# Altium schematic sheet VCO_OUT_channel.SchDoc: Output stage :
size 420 x 297 mm; Author: K.B.; CompanyName: WUT; DrawnBy: K.B.; Organization: WUT ISE; Address1: Warsaw Univeristy of Technology; Address2: Nowowiejska 15/19; DocumentNumber: 4; SheetNumber: 4; SheetTotal: 12; EDA_Number: ARTIQ; Projet: ARTIQ/SINARA; ModifiedBy: -; CreateDate: XX/XX/XXXX; CheckedDate: -; Title2: Attenuator, amplifier and filter; DivGrp: ISE; Designer: K.B.; ModifiedDate: -; ProjectName: ARTIQ/SINARA
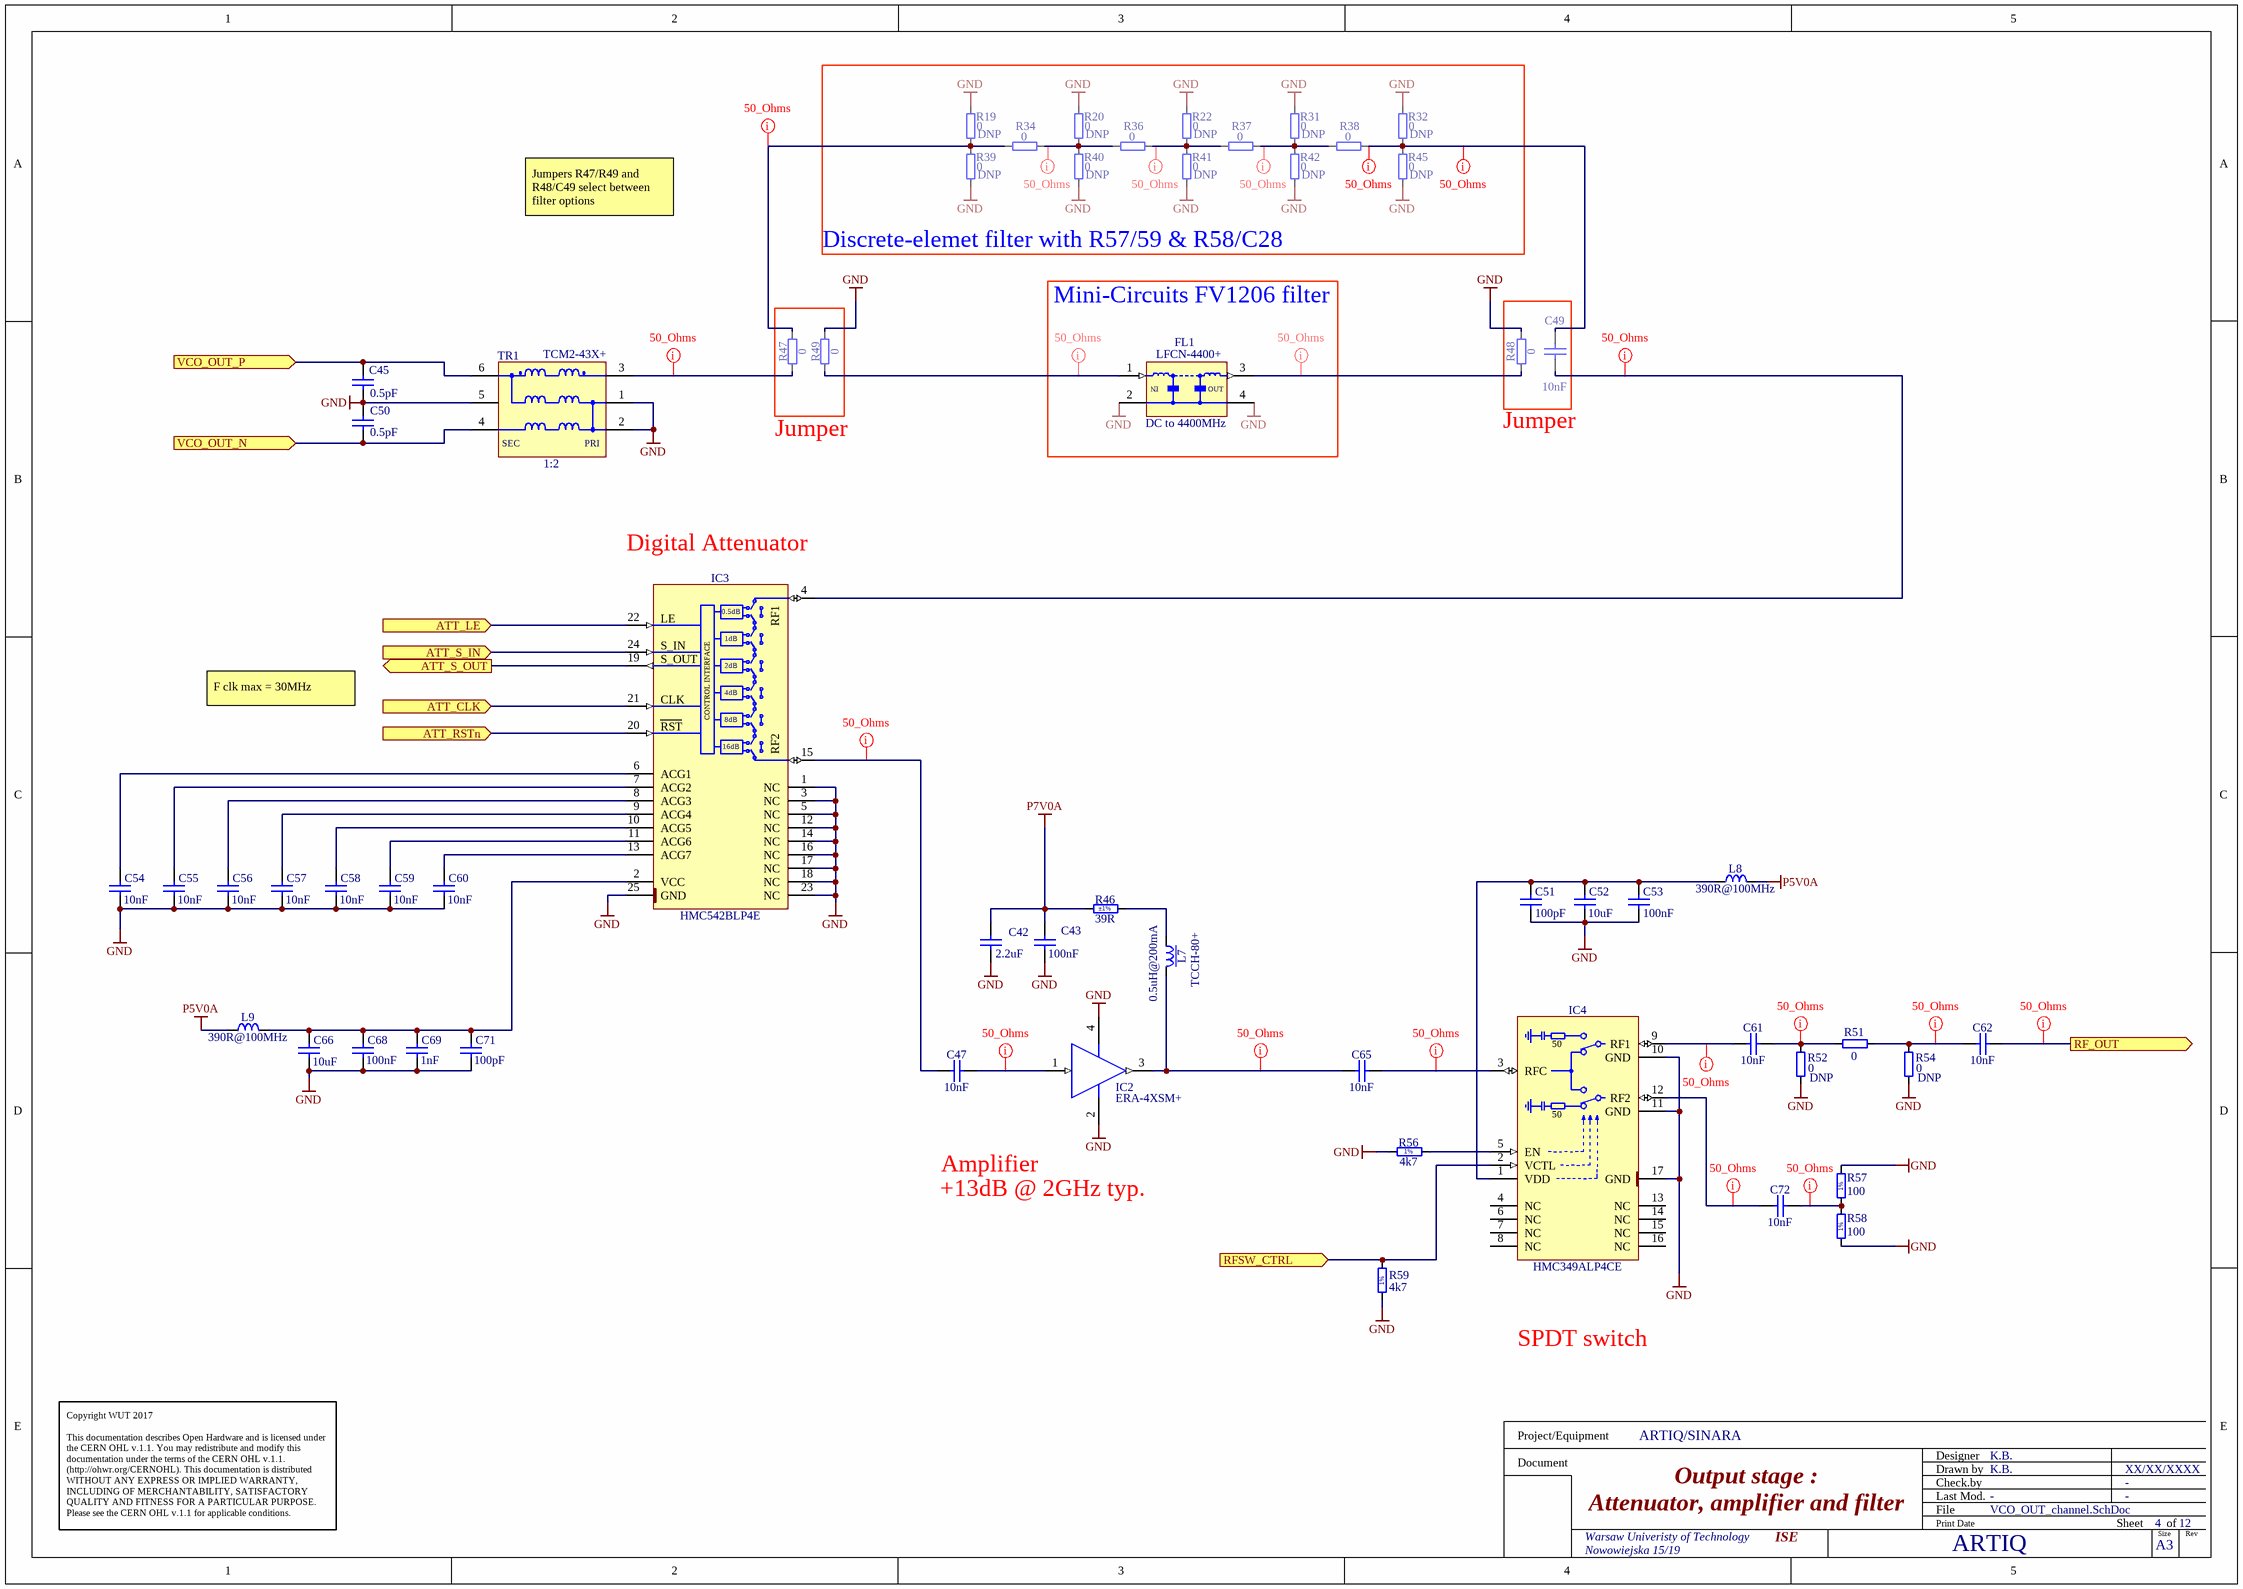
[diagram p0: VCO_OUT_channel.SchDoc]

## Parts
C42  2.2uF  [CAPC2012X140N]
C43  100nF  [CAPC1005X55N]
C45  0.5pF  [CAPC0402(1005)60_M]
C47  10nF  [CAPC1005X55N]
C49  10nF  [CAPC1005X55N]
C50  0.5pF  [CAPC0402(1005)60_M]
C51  100pF  [CAPC1005X55N]
C52  10uF  [CAPC1608X80N]
C53  100nF  [CAPC1005X55N]
C54  10nF  [CAPC1005X55N]
C55  10nF  [CAPC1005X55N]
C56  10nF  [CAPC1005X55N]
C57  10nF  [CAPC1005X55N]
C58  10nF  [CAPC1005X55N]
C59  10nF  [CAPC1005X55N]
C60  10nF  [CAPC1005X55N]
C61  10nF  [CAPC1005X55N]
C62  10nF  [CAPC1005X55N]
C65  10nF  [CAPC1005X55N]
C66  10uF  [CAPC1608X80N]
C68  100nF  [CAPC1005X55N]
C69  1nF  [CAPC1005X55N]
C71  100pF  [CAPC1005X55N]
C72  10nF  [CAPC1005X55N]
FL1  DC to 4400MHz  Manufacturer Part Number: LFCN-4400+  [FIL_MINI-CIRCUITS_FV1206]
IC2  ERA-4XSM+  [MINI-CIRCUITS_WW107]
IC3  HMC542BLP4E  [QFN50P400X400X100-25N-S295]
IC4  HMC349ALP4CE  [QFN65P400X400X100-17N-S255]
L7  0.5uH@200mA  Manufacturer Part Number: TCCH-80+  [IND_MINI-CIRCUITS_GU1604]
L8  390R@100MHz  [INDC1608X95N]
L9  390R@100MHz  [INDC1608X95N]
R19  0  Mounted: DNP  [RESC1005X40N]
R20  0  Mounted: DNP  [RESC1005X40N]
R22  0  Mounted: DNP  [RESC1005X40N]
R31  0  Mounted: DNP  [RESC1005X40N]
R32  0  Mounted: DNP  [RESC1005X40N]
R34  0  [RESC1005X40N]
R36  0  [RESC1005X40N]
R37  0  [RESC1005X40N]
R38  0  [RESC1005X40N]
R39  0  Mounted: DNP  [RESC1005X40N]
R40  0  Mounted: DNP  [RESC1005X40N]
R41  0  Mounted: DNP  [RESC1005X40N]
R42  0  Mounted: DNP  [RESC1005X40N]
R45  0  Mounted: DNP  [RESC1005X40N]
R46  39R  Tolerance: ±1%  [RESC3225X70N]
R47  0  [RESC1005X40N]
R48  0  [RESC1005X40N]
R49  0  [RESC1005X40N]
R51  0  [RESC1005X40N]
R52  0  Mounted: DNP  [RESC1005X40N]
R54  0  Mounted: DNP  [RESC1005X40N]
R56  4k7  [RESC1005X40N]
R57  100  [RESC1005X40N]
R58  100  [RESC1005X40N]
R59  4k7  [RESC1005X40N]
TR1  1:2  Manufacturer Part Number: TCM2-43X+  [XFMR_MINI-CIRCUITS_DB1627]

## Blocks framed on the sheet
Discrete-elemet filter with R57/59 & R58/C28: R19 R20 R22 R31 R32 R34 R36-R42 R45
Mini-Circuits FV1206 filter: FL1

## Ports
ATT_CLK (in), ATT_LE (in), ATT_RSTn (in), ATT_S_IN (in), ATT_S_OUT (out), RF_OUT (out), RFSW_CTRL (in), VCO_OUT_N (in), VCO_OUT_P (in)

## Nets
GND: C42.1 C43.1 C45.1 C50.2 C51.2 C52.1 C53.1 C54.1 C55.1 C56.1 C57.1 C58.1 C59.1 C60.1 C66.1 C68.1 C69.1 C71.1 FL1.2(GND) FL1.4(GND) IC2.2(GND) IC2.4(GND) IC3.1(NC) IC3.3(NC) IC3.5(NC) IC3.12(NC) IC3.14(NC) IC3.16(NC) IC3.17(NC) IC3.18(NC) IC3.23(NC) IC3.25(GND) IC4.10(GND) IC4.11(GND) IC4.17(GND) R19.1 R20.1 R22.1 R31.1 R32.1 R39.1 R40.1 R41.1 R42.1 R45.1 R48.1 R49.2 R52.1 R54.1 R56.1 R57.2 R58.1 R59.1 TR1.1(P1) TR1.2(P1) TR1.5(NC)
P5V0A: L8.2 L9.1
P7V0A: C42.2 C43.2 R46.1
ATT_CLK: IC3.21(SHIFT_CLOCK) ; port ATT_CLK
ATT_LE: IC3.22(LATCH_ENABLE) ; port ATT_LE
ATT_RSTn: IC3.20(~{RESET}) ; port ATT_RSTn
ATT_S_IN: IC3.24(SERIAL_INPUT) ; port ATT_S_IN
ATT_S_OUT: IC3.19(SERIAL_OUTPUT) ; port ATT_S_OUT
RF_OUT: C62.2 ; port RF_OUT
RFSW_CTRL: IC4.2(VCTL) R59.2 ; port RFSW_CTRL
VCO_OUT_N: C50.1 TR1.4(S1) ; port VCO_OUT_N
VCO_OUT_P: C45.2 TR1.6(S1) ; port VCO_OUT_P
NetC47_1: C47.1 IC3.15(RF2)
NetC47_2: C47.2 IC2.1(RF_IN)
NetC49_1: C49.1 IC3.4(RF1)
NetC49_2: C49.2 R32.2 R38.1 R45.2
NetC51_1: C51.1 C52.2 C53.2 IC4.1(VDD) L8.1
NetC54_2: C54.2 IC3.6(ACG1)
NetC55_2: C55.2 IC3.7(ACG2)
NetC56_2: C56.2 IC3.8(ACG3)
NetC57_2: C57.2 IC3.9(ACG4)
NetC58_2: C58.2 IC3.10(ACG5)
NetC59_2: C59.2 IC3.11(ACG6)
NetC60_2: C60.2 IC3.13(ACG7)
NetC61_1: C61.1 IC4.9(RF1)
NetC61_2: C61.2 R51.1 R52.2
NetC62_1: C62.1 R51.2 R54.2
NetC65_1: C65.1 IC2.3(RF_OUT) L7.3
NetC65_2: C65.2 IC4.3(RFC)
NetC66_2: C66.2 C68.2 C69.2 C71.2 IC3.2(VCC) L9.2
NetC72_1: C72.1 IC4.12(RF2)
NetC72_2: C72.2 R57.1 R58.2
NetFL1_1: FL1.1(RFIN) R49.1
NetFL1_3: FL1.3(RFOUT) R48.2
NetIC4_5: IC4.5(EN) R56.2
NetL7_1: L7.1 R46.2
NetR19_2: R19.2 R34.1 R39.2 R47.2
NetR20_2: R20.2 R34.2 R36.1 R40.2
NetR22_2: R22.2 R36.2 R37.1 R41.2
NetR31_2: R31.2 R37.2 R38.2 R42.2
NetR47_1: R47.1 TR1.3(P1)

Not connected (* = marked no-connect by the designer): IC4 4(NC) 6(NC) 7(NC) 8(NC) 13(NC) 14(NC) 15(NC) 16(NC)

## Layout directives
net class 50_Ohms: NetC47_1, NetC47_2, NetC49_1, NetC49_2, NetC61_1, NetC61_2, NetC62_1, NetC65_1, NetC65_2, NetC72_1, NetC72_2, NetFL1_1, NetFL1_3, NetR19_2, NetR20_2, NetR22_2, NetR31_2, NetR47_1, RF_OUT

## Notes on the sheet
- Jumpers R47/R49 and R48/C49 select between filter options
- Jumper
- (near IC3) Digital Attenuator
- F clk max = 30MHz
- +13dB @ 2GHz typ.
- Amplifier
- SPDT switch
- Copyright WUT 2017
  This documentation describes Open Hardware and is licensed under the CERN OHL v.1.1. You may redistribute and modify this documentation under the terms of the CERN OHL v.1.1. (http://ohwr.org/CERNOHL). This documentation is distributed WITHOUT ANY EXPRESS OR IMPLIED WARRANTY, INCLUDING OF MERCHANTABILITY, SATISFACTORY QUALITY AND FITNESS FOR A PARTICULAR PURPOSE. Please see the CERN OHL v.1.1 for applicable conditions.
- Project/Equipment
- Document
- Designer
- Drawn by
- Check.by
- File
- Last Mod.
- Print Date
- Sheet
- Size
- A3
- of
- Rev
- (in symbol FIL_MINI-CIRCUITS_LFCN-320) IN; OUT
- (in symbol HMC349ALP4CE) 50
- (in symbol HMC542BLP4E) 0.5dB; LE; 1dB; S_IN; S_OUT; 2dB; CONTROL INTERFACE; 4dB; CLK; 8dB; RST; 16dB
- (in symbol R0402_4K7_1%_0.0625W_100PPM) 1%
- (in symbol R0402_100R_1%_0.1W_100PPM) 1%
- (in symbol XFMR_MINI-CIRCUITS_TCM2-43X+) SEC; PRI

## Library data of the parts
C42 = CC0805_1UF_35V_20%_X7R: Non-polarised capacitor; Part Number: CC0805_2U2F_25V_20%_X7R; Part Description: SMD Multilayer Chip Ceramic Capacitor; Manufacturer: GENERIC; Manufacturer1 Part Number: TMK212B7225MG-TR; Voltage: 25V; TC: X7R; Tolerance: ±20%; Component Kind: Standard; Component Type: Standard; Pin Count: 2; Value: 2.2uF; Status: Not Recommended; Manufacturer Part Number: CC0805_2U2F_25V_20%_X7R; Case: 0805; Mounted: Yes; Socket: No; SMD: Yes; Sense: No; Manufacturer1 Example: TAIYO YUDEN; Manufacturer1 ComponentHeight: 1.35mm; HelpURL: \\cern.ch\dfs\Applications\Altium\Datasheets\CC0805_X7R_TAIYO-YUDEN_HIGH-VALUE.pdf; Author: CERN DEM JLC; CreateDate: 2011-06-22; LatestRevisionDate: 2011-06-22
C43 C53 C68 = CC0402_100NF_16V_10%_X7R: Non-polarised capacitor; Part Description: SMD Multilayer Chip Ceramic Capacitor; Manufacturer: GENERIC; Manufacturer1 Part Number: GRM155R71C104KA88D; Voltage: 16V; TC: X7R; Tolerance: ±10%; Part Number: CC0402_100NF_16V_10%_X7R; Component Kind: Standard; Component Type: Standard; Pin Count: 2; Value: 100nF; Status: Not Recommended; Manufacturer Part Number: CC0402_100NF_16V_10%_X7R; Case: 0402; Mounted: Yes; Socket: No; SMD: Yes; Sense: No; Manufacturer1 Example: MURATA; Manufacturer1 ComponentHeight: 0.55mm; HelpURL: \\cern.ch\dfs\Applications\Altium\Datasheets\CC0402_X7R_MURATA_GRM.pdf; Author: CERN DEM JLC; CreateDate: 2013-12-05; LatestRevisionDate: 2007-12-03
C45 C50 = CMP-1034-00013-1: CAP 0.5pF 10V ±0.1pF 0402 (1005 Metric) Thickness 0.6mm SMD; Case-Metric: 1005; Tolerance: Â±0.1pF; Case-EIA: 0402; Value: 0.5pF; Max Thickness: 0.6 mm; Rated Voltage: 10 V; Technology: SMT
C47 C49 C54-C62 C65 C72 = CC0402_10NF_16V_10%_X7R: Non-polarised capacitor; Part Description: SMD Multilayer Chip Ceramic Capacitor; Manufacturer: GENERIC; Manufacturer1 Part Number: 223878715636; Voltage: 16V; TC: X7R; Tolerance: ±10%; Part Number: CC0402_10NF_16V_10%_X7R; Component Kind: Standard; Component Type: Standard; Pin Count: 2; Value: 10nF; Status: Not Recommended; Manufacturer Part Number: CC0402_10NF_16V_10%_X7R; Case: 0402; Mounted: Yes; Socket: No; SMD: Yes; Sense: No; Manufacturer1 Example: PHYCOMP; Manufacturer1 ComponentHeight: 0.55mm; HelpURL: \\cern.ch\dfs\Applications\Altium\Datasheets\CC0402_X7R_PHYCOMP.pdf; Author: CERN DEM JLC; CreateDate: 2007-12-03; LatestRevisionDate: 2007-12-03
C51 C71 = CC0402_100PF_50V_5%_C0G: Non-polarised capacitor; Part Description: SMD Multilayer Chip Ceramic Capacitor; Manufacturer: GENERIC; Manufacturer1 Part Number: C0402C101J5GACTU; Voltage: 50V; TC: C0G/NP0; Tolerance: ±5%; Part Number: CC0402_100PF_50V_5%_C0G; Component Kind: Standard; Component Type: Standard; Pin Count: 2; Value: 100pF; Status: Preferred; Manufacturer Part Number: CC0402_100PF_50V_5%_C0G; Case: 0402; Mounted: Yes; Socket: No; SMD: Yes; Sense: No; Manufacturer1 Example: KEMET; Manufacturer1 ComponentHeight: 0.55mm; HelpURL: \\cern.ch\dfs\Applications\Altium\Datasheets\CC0805_C0G_KEMET_(Commercial Grade).pdf; Author: CERN DEM JLC; CreateDate: 2007-12-03; LatestRevisionDate: 2015-04-22
C52 C66 = CC0603_10UF_16V_20%_X5R: Non-polarised capacitor; Part Description: SMD Multilayer Chip Ceramic Capacitor; Manufacturer: GENERIC; Manufacturer1 Part Number: GRM188R61C106MA73D; Voltage: 16V; TC: X5R; Tolerance: ±20%; Part Number: CC0603_10UF_16V_20%_X5R; Component Kind: Standard; Component Type: Standard; Pin Count: 2; Value: 10uF; Status: None; Manufacturer Part Number: CC0603_10UF_16V_20%_X5R; Case: 0603; Mounted: Yes; Socket: No; SMD: Yes; Sense: No; Manufacturer1 Example: MURATA; Manufacturer1 ComponentHeight: 0.8mm; HelpURL: \\cern.ch\dfs\Applications\Altium\Datasheets\CC0603_X5R_MURATA_GRM.pdf; Author: CERN DEM MR; CreateDate: 2016-03-02; LatestRevisionDate: 2016-03-02
C69 = CC0402_1NF_50V_10%_X7R: Non-polarised capacitor; Part Description: SMD Multilayer Chip Ceramic Capacitor; Manufacturer: GENERIC; Manufacturer1 Part Number: 223858715623; Voltage: 50V; TC: X7R; Tolerance: ±10%; Part Number: CC0402_1NF_50V_10%_X7R; Component Kind: Standard; Component Type: Standard; Pin Count: 2; Value: 1nF; Status: Not Recommended; Manufacturer Part Number: CC0402_1NF_50V_10%_X7R; Case: 0402; Mounted: Yes; Socket: No; SMD: Yes; Sense: No; Manufacturer1 Example: PHYCOMP; Manufacturer1 ComponentHeight: 0.55mm; HelpURL: \\cern.ch\dfs\Applications\Altium\Datasheets\CC0402_X7R_PHYCOMP.pdf; Author: CERN DEM JLC; CreateDate: 2007-12-03; LatestRevisionDate: 2007-12-03
FL1 = FIL_MINI-CIRCUITS_LFCN-320: 50 Ohm DC to 4400MHz Low Pass Filter; Part Number: FIL_MINI-CIRCUITS_LFCN-4400+; Part Description: 50 Ohm Low Pass Filter; Component Kind: Standard; Component Type: Standard; Pin Count: 2; Value: DC to 4400MHz; Status: None; Manufacturer: MINI-CIRCUITS; Mounted: Yes; Socket: No; SMD: Yes; Sense: No; ComponentHeight: 0.94mm; HelpURL: \\cern.ch\dfs\Applications\Altium\Datasheets\FIL_MINI-CIRCUITS_LFCN-4000+.pdf; Author: CERN DEM JLC; CreateDate: 2013-12-09; LatestRevisionDate: 2013-12-09
IC2 = ERA-4XSM+: DC-4GHz Monolithic Amplifier; Manufacturer: MINI-CIRCUITS; PressFit: No; Bonding: No; Part Number: ERA-4XSM+; Component Kind: Standard; Component Type: Standard; Device: ERA-4XSM+; PackageDescription: MINI-CIRCUITS WW107 Case, Body 2.16mm Diameter X 1.52mm H; Part Description: DC-4GHz Monolithic Amplifier; Manufacturer Part Number: ERA-4XSM+; Pin Count: 4; Mounted: Yes; Socket: No; SMD: Yes; Sense: No; ComponentHeight: 1.52mm; Author: CERN DEM JMW; HelpURL: \\cern.ch\dfs\Applications\Altium\Datasheets\ERA-4XSM+.pdf; CreateDate: 11.08.2016; LatestRevisionDate: 11.08.2016
IC3 = HMC542BLP4E: 0.5dB LSB GaAs MMIC 6-bit Digital Serial Control Attenuator, DC - 4GHz; Part Description: 0.5dB LSB GaAs MMIC 6-bit Digital Serial Control Attenuator, DC to 4GHz; Manufacturer: HITTITE MICROWAVE CORP; PressFit: No; Bonding: No; Part Number: HMC542BLP4E; Component Kind: Standard; Component Type: Standard; Device: HMC542BLP4E; PackageDescription: QFN, 0.50mm Pitch, Square; 24 Pin, 4.00mm L X 4.00mm W X 1.00mm H Body (w/thermal Tab 2.95 X 2.95mm), IPC Medium Density; Manufacturer Part Number: HMC542BLP4E; Pin Count: 25; Case: QFN24; Mounted: Yes; Socket: No; SMD: Yes; Sense: No; ComponentHeight: 1mm; Author: CERN DEM JMW; HelpURL: \\cern.ch\dfs\Applications\Altium\Datasheets\HMC542BLP4E.pdf; CreateDate: 2016-08-17; LatestRevisionDate: 2016-08-17
IC4 = HMC349ALP4CE: DC-4GHz High Isolation SPDT Non-Reflective Switch; Manufacturer: ANALOG DEVICES; PressFit: No; Bonding: No; Part Number: HMC349ALP4CE; Component Kind: Standard; Component Type: Standard; Device: HMC349ALP4CE; PackageDescription: QFN, 0.65mm pitch,square; 4 pin X 4 pin, 4mm X 4mm X 1mm H body (w/thermal tab 2.55 X 2.55mm),  IPC Medium Density; Part Description: DC-4GHz High Isolation SPDT Non-Reflective Switch; Manufacturer Part Number: HMC349ALP4CE; Pin Count: 17; Case: QFN16; Mounted: Yes; Socket: No; SMD: Yes; Sense: No; ComponentHeight: 1mm; Author: CERN DEM JLC; HelpURL: \\cern.ch\dfs\Applications\Altium\Datasheets\HMC349ALP4CE.pdf; CreateDate: 2017-02-23; LatestRevisionDate: 2017-02-23
L7 = IND_MINI-CIRCUITS_TCCH-80+: 50 Ohms, 50 to 8200 MHz RF Choke; Power: 200mA; Resistance: 0.1R; Part Number: IND_MINI-CIRCUITS_TCCH-80+; Component Kind: Standard; Component Type: Standard; Pin Count: 4; Value: 0.5uH@200mA; Status: None; Part Description: 50 Ohms, 50 to 8200 MHz RF Choke; Manufacturer: MINI-CIRCUITS; Mounted: Yes; Socket: No; SMD: Yes; Sense: No; ComponentHeight: 3.81mm; HelpURL: \\cern.ch\dfs\Applications\Altium\Datasheets\IND_MINI-CIRCUITS_TCCH-80+.pdf; Author: CERN DEM JLC; CreateDate: 2011-12-19; LatestRevisionDate: 2011-12-19
L8 L9 = IND0603_TDK_MPZ1608R391A: Inductor; Part Description: SMT Chip Bead for Power Line; Manufacturer: TDK; Power: 1.2A; Resistance: 0.12R; Tolerance: ±25%; Part Number: IND0603_TDK_MPZ1608R391A; Component Kind: Standard; Component Type: Standard; Pin Count: 2; Value: 390R@100MHz; Status: None; Manufacturer Part Number: MPZ1608R391A; Case: 0603; Mounted: Yes; Socket: No; SMD: Yes; Sense: No; ComponentHeight: 0.95mm; HelpURL: \\cern.ch\dfs\Applications\Altium\Datasheets\IND0603_TDK_MPZ1608.pdf; Author: CERN DEM JLC; CreateDate: 2009-12-02; LatestRevisionDate: 2009-12-02
R19 R20 R22 R31 R32 R34 R36-R42 R45 R47-R49 R51 R52 R54 = R0402_0R_JUMPER: Resistor; Part Description: 1A (0.05R Max DC Resistance) Zero Ohm Jumper; Manufacturer: GENERIC; Manufacturer1 Part Number: 232270591001L; Part Number: R0402_0R_JUMPER; Component Kind: Standard; Component Type: Standard; Pin Count: 2; Value: 0; Status: Not recommended; Manufacturer Part Number: R0402_0R_JUMPER; Case: 0402; Sense: No; Socket: No; SMD: Yes; Manufacturer1 Example: YAGEO PHYCOMP; Manufacturer1 ComponentHeight: 0.4mm; HelpURL: \\cern.ch\dfs\Applications\Altium\Datasheets\R0402_Phycomp_RC0402.pdf; Author: CERN DEM JLC; CreateDate: 2007-12-03; LatestRevisionDate: 2012-10-17
  R34 R36-R38 R47-R49 R51: Mounted: Yes
R46 = R1210_39R_1%_0.5W_100PPM: Resistor - 1%; Part Description: Thick Film Chip Resistor; Manufacturer: Panasonic; Manufacturer Part Number: ERJU14F39R0U; Power: 0.5W; TC: ±100ppm/°C; PressFit: No; Part Number: R1210_39R_1%_0.5W_100PPM; Component Kind: Standard; Component Type: Standard; Pin Count: 2; Value: 39R; Status: None; Case: 1210; Mounted: Yes; Sense: No; Socket: No; SMD: Yes; ComponentHeight: 0.7mm; HelpURL: \\cern.ch\dfs\Applications\Altium\Datasheets\R1210_VISHAY_CRCW1210.pdf; Author: GK; CreateDate: 06.08.2014; LatestRevisionDate: 06.08.2014
R56 R59 = R0402_4K7_1%_0.0625W_100PPM: Resistor - 1%; Part Description: General Purpose Thick Film Chip Resistor; Manufacturer: GENERIC; Manufacturer1 Part Number: 232270674702L; TC: ±100ppm/°C; Part Number: R0402_4K7_1%_0.0625W_100PPM; Component Kind: Standard; Component Type: Standard; Pin Count: 2; Value: 4k7; Status: Not recommended; Power: 0.0625W; Tolerance: ±1%; Manufacturer Part Number: R0402_4K7_1%_0.0625W_100PPM; Case: 0402; Mounted: Yes; Sense: No; Socket: No; SMD: Yes; Manufacturer1 Example: YAGEO PHYCOMP; Manufacturer1 ComponentHeight: 0.4mm; HelpURL: \\cern.ch\dfs\Applications\Altium\Datasheets\R0402_Phycomp_RC0402.pdf; Author: CERN DEM JLC; CreateDate: 2007-12-03; LatestRevisionDate: 2012-10-17
R57 R58 = R0402_100R_1%_0.1W_100PPM: Resistor - 1%; Part Description: General Purpose Thick Film Chip Resistor; Manufacturer: GENERIC; Manufacturer Part Number: R0402_100R_1%_0.1W_100PPM_50V; Manufacturer1 Part Number: ERJ2RKF1000X; Power: 0.1W; TC: ±100ppm/°C; Voltage: 50V; Part Number: R0402_100R_1%_0.1W_100PPM; Component Kind: Standard; Component Type: Standard; Pin Count: 2; Value: 100; Status: Not recommended; Tolerance: ±1%; Case: 0402; Mounted: Yes; Sense: No; Socket: No; SMD: Yes; Manufacturer1 Example: PANASONIC; Manufacturer1 ComponentHeight: 0.4mm; HelpURL: \\cern.ch\dfs\Applications\Altium\Datasheets\R0402_PANASONIC_ERJ2RK.pdf; Author: CERN DEM JLC; CreateDate: 12.12.2013; LatestRevisionDate: 03.03.2015
TR1 = XFMR_MINI-CIRCUITS_TCM2-43X+: 50 OHMS 10 to 4000 MHz RF Transformer; Power: 0.4W; Part Number: XFMR_MINI-CIRCUITS_TCM2-43X+; Component Kind: Standard; Component Type: Standard; Pin Count: 6; Value: 1:2; Status: None; Part Description: 50 Ohms 10 to 4000MHz RF Transformer; Manufacturer: MINI-CIRCUITS; Mounted: Yes; Socket: No; Sense: No; SMD: Yes; ComponentHeight: 4.06mm; HelpURL: \\cern.ch\dfs\Applications\Altium\Datasheets\XFMR_MINI-CIRCUITS_TCM2-43X+.pdf; Author: CERN DEM BC; CreateDate: 2016-02-12; LatestRevisionDate: 2016-02-12